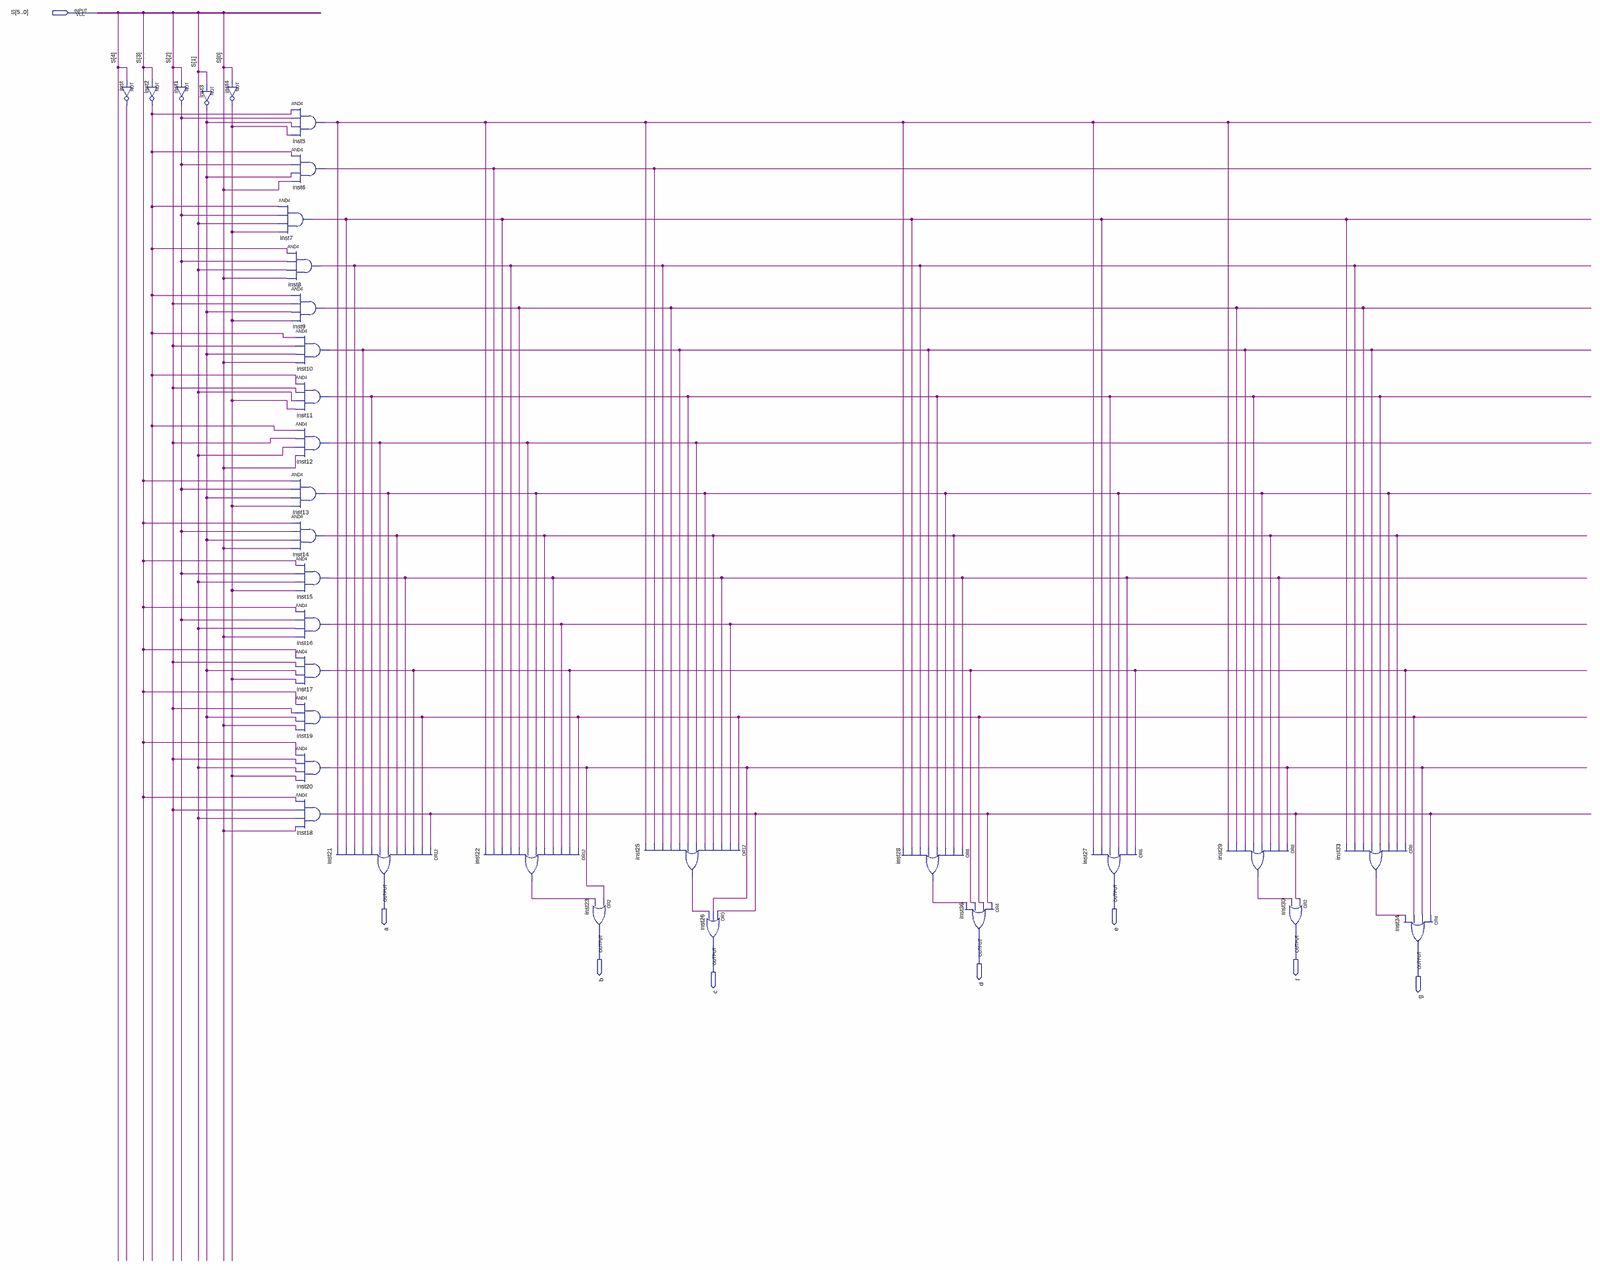
[diagram p0: schematic sheet, whole]
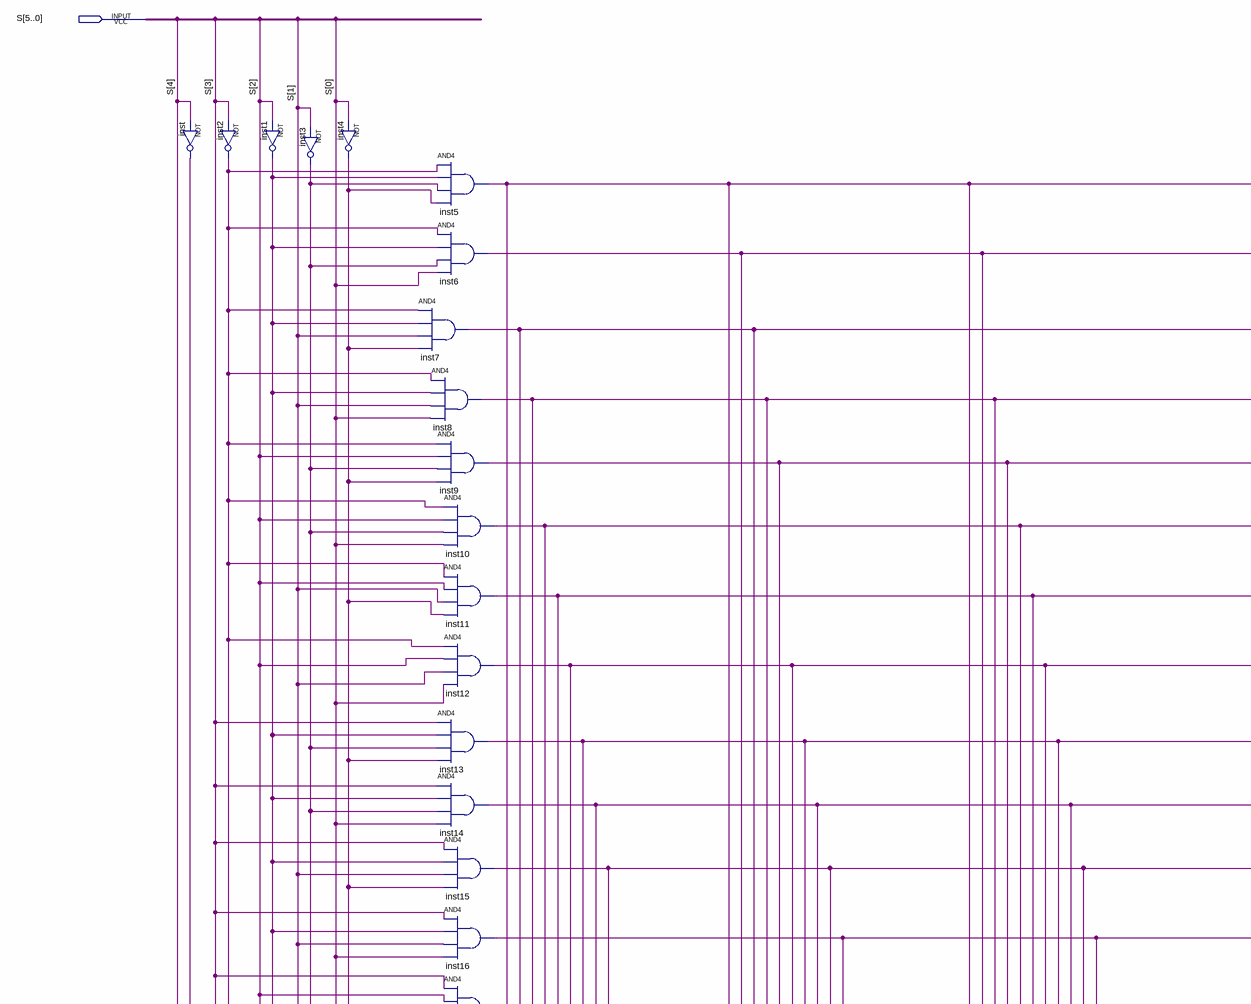
[diagram p1: schematic sheet, upper left part]
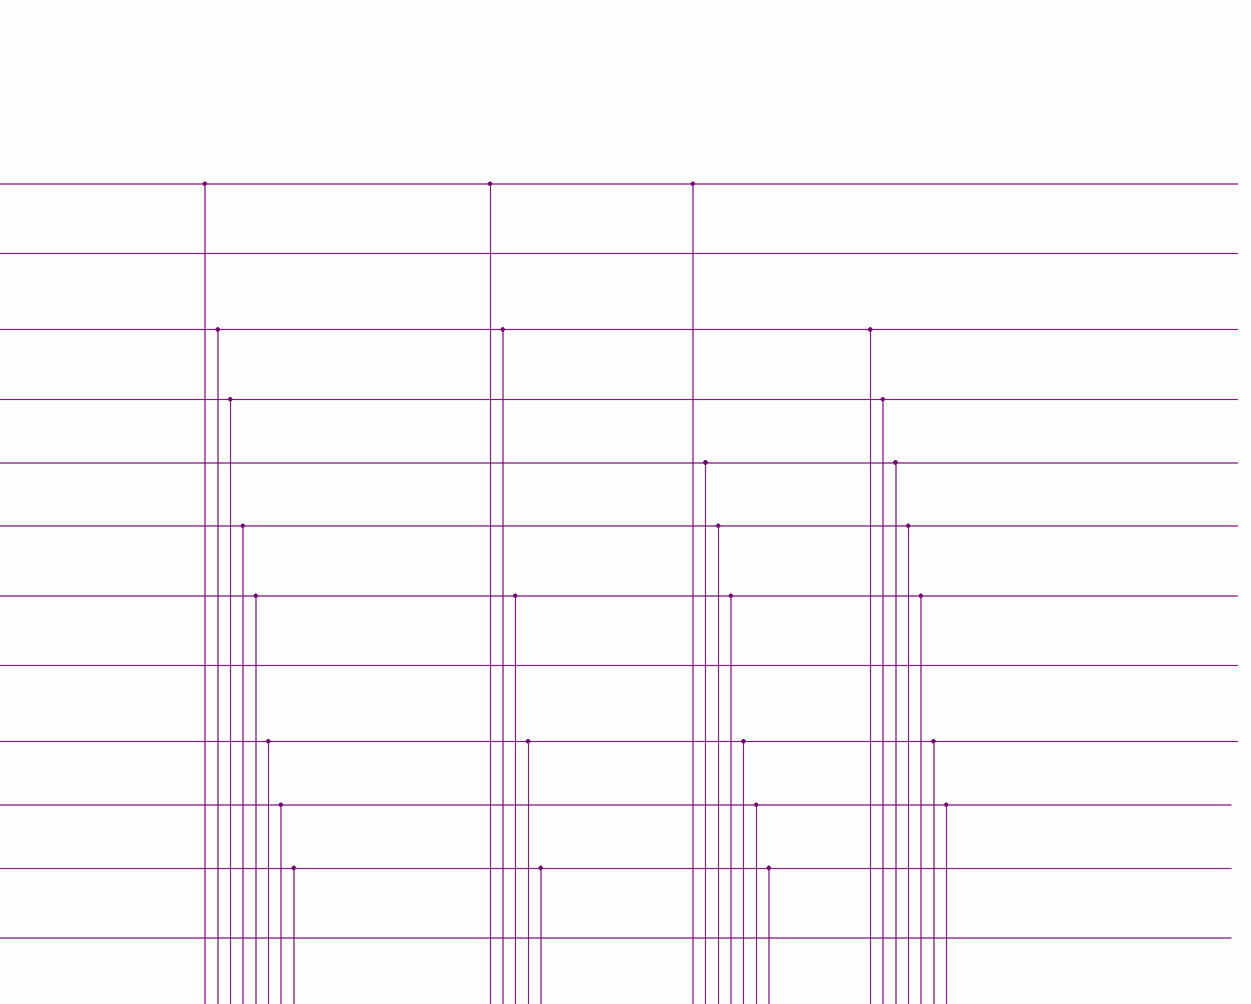
[diagram p2: schematic sheet, upper right part]
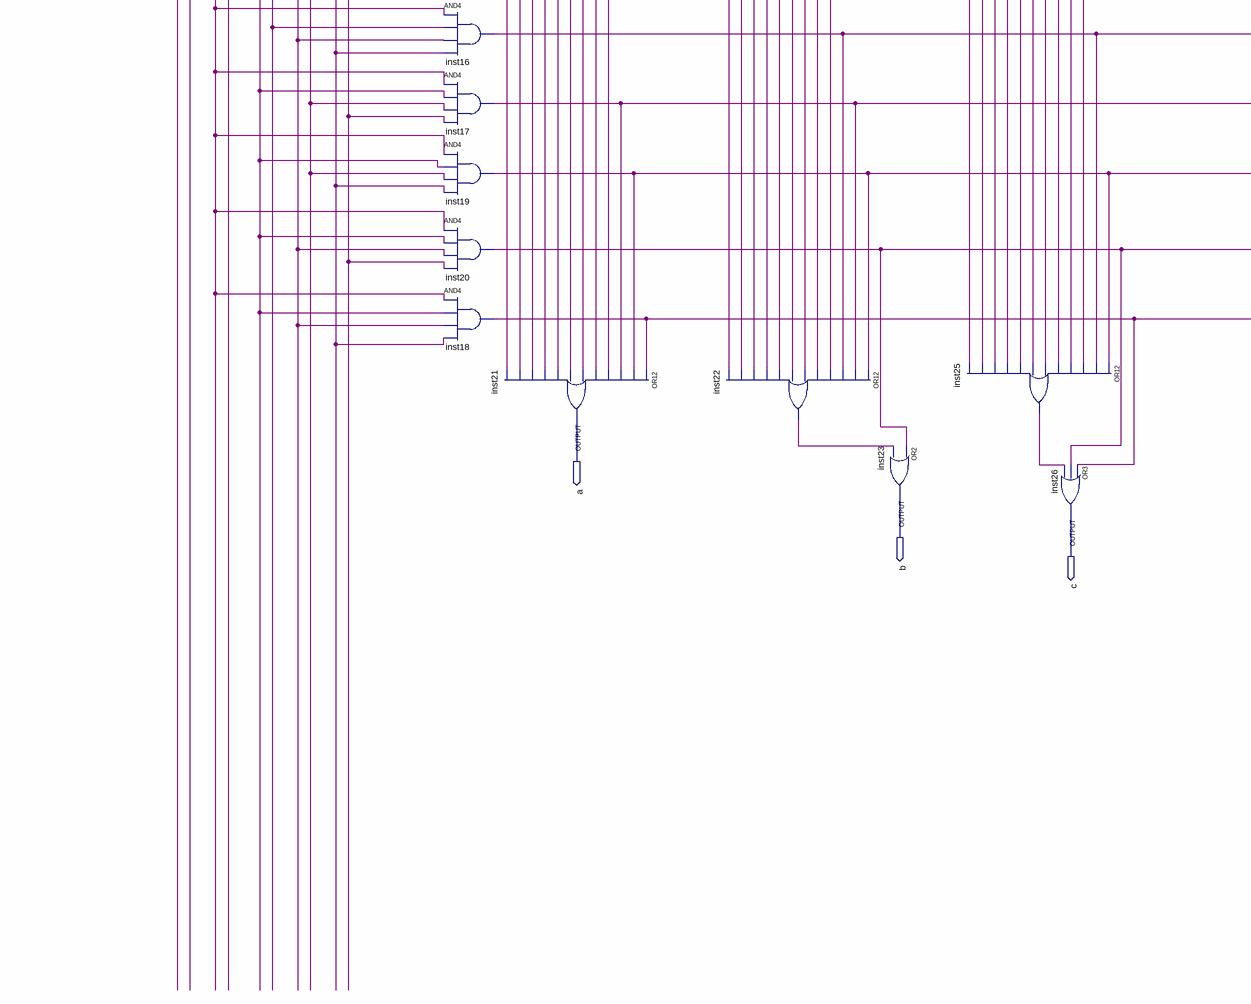
[diagram p3: schematic sheet, lower left part]
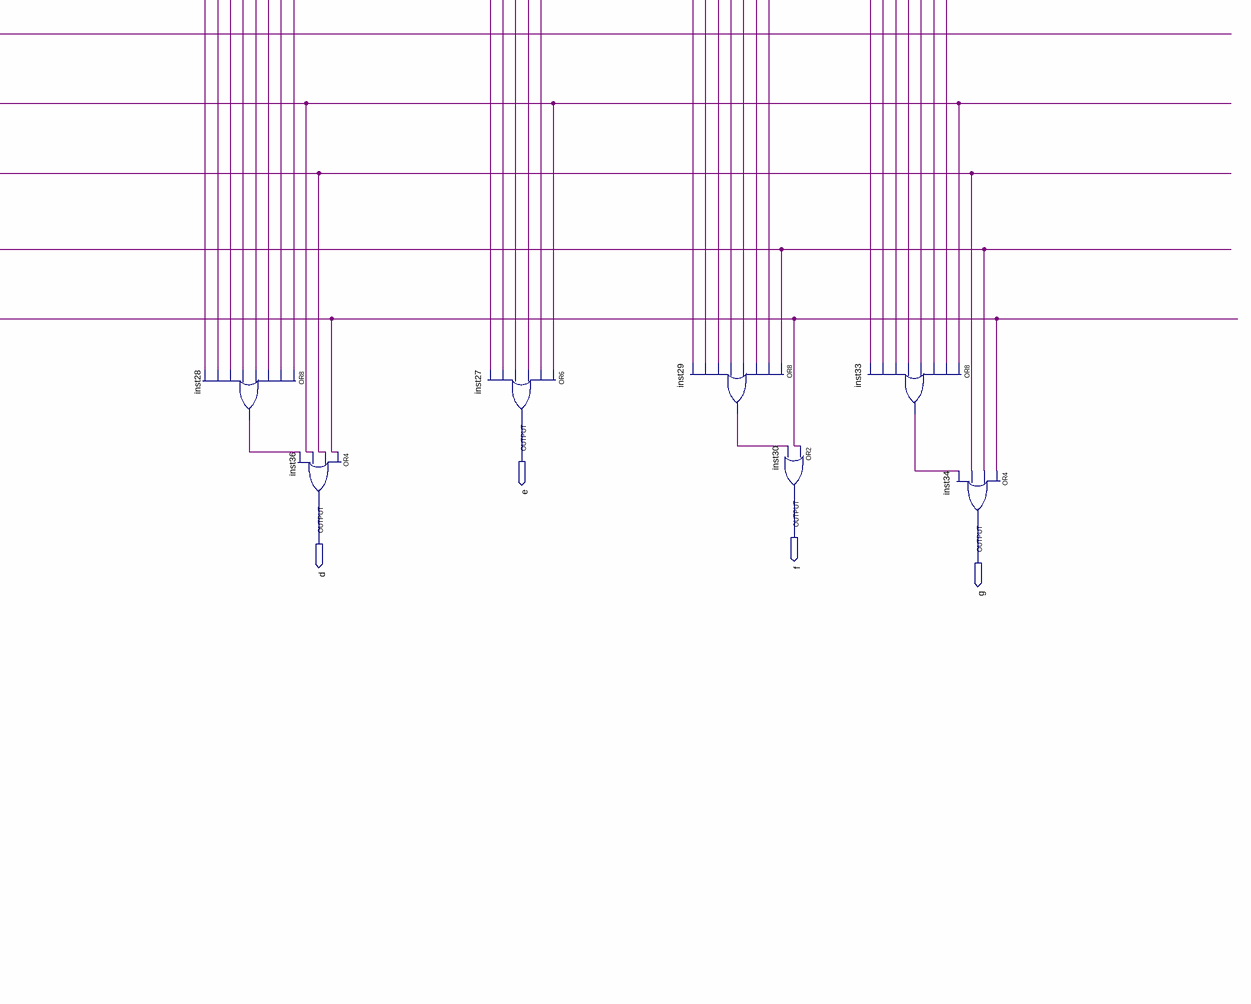
[diagram p4: schematic sheet, lower right part]
// Quartus schematic decodificador.bdf as structural Verilog: 33 symbols, 8 pins
module decodificador (
  input  [5:0] S,
  output a,
  output e,
  output b,
  output f,
  output d,
  output c,
  output g
);

  wire inst1_out, inst2_out, inst3_out, inst4_out, inst5_out, inst6_out, inst7_out, inst8_out, inst9_out,
       inst10_out, inst11_out, inst12_out, inst13_out, inst14_out, inst15_out, inst16_out, inst17_out,
       inst18_out, inst19_out, inst20_out, inst22_out, inst25_out, inst28_out, inst29_out, inst33_out,
       inst_out;

  not inst (inst_out, S[4]);
  not inst2 (inst2_out, S[3]);
  not inst1 (inst1_out, S[2]);
  not inst3 (inst3_out, S[1]);
  not inst4 (inst4_out, S[0]);
  and inst5 (inst5_out, inst2_out, inst1_out, inst3_out, inst4_out);
  and inst6 (inst6_out, inst2_out, inst1_out, inst3_out, S[0]);
  and inst7 (inst7_out, inst2_out, inst1_out, S[1], inst4_out);
  and inst8 (inst8_out, inst2_out, inst1_out, S[1], S[0]);
  and inst9 (inst9_out, inst2_out, S[2], inst3_out, inst4_out);
  and inst10 (inst10_out, inst2_out, S[2], inst3_out, S[0]);
  and inst11 (inst11_out, inst2_out, S[2], S[1], inst4_out);
  and inst12 (inst12_out, inst2_out, S[2], S[1], S[0]);
  and inst13 (inst13_out, S[3], inst1_out, inst3_out, inst4_out);
  and inst14 (inst14_out, S[3], inst1_out, inst3_out, S[0]);
  and inst15 (inst15_out, S[3], inst1_out, S[1], inst4_out);
  and inst16 (inst16_out, S[3], inst1_out, S[1], S[0]);
  and inst17 (inst17_out, S[3], S[2], inst3_out, inst4_out);
  and inst19 (inst19_out, S[3], S[2], inst3_out, S[0]);
  and inst20 (inst20_out, S[3], S[2], S[1], inst4_out);
  and inst18 (inst18_out, S[3], S[2], S[1], S[0]);
  or inst21 (a, inst18_out, inst19_out, inst17_out, inst15_out, inst14_out, inst13_out, inst12_out, inst11_out, inst10_out, inst8_out, inst7_out, inst5_out);
  or inst22 (inst22_out, inst19_out, inst17_out, inst16_out, inst15_out, inst14_out, inst13_out, inst12_out, inst9_out, inst8_out, inst7_out, inst6_out, inst5_out);
  or inst23 (b, inst20_out, inst22_out);
  or inst25 (inst25_out, inst19_out, inst16_out, inst15_out, inst14_out, inst13_out, inst12_out, inst11_out, inst10_out, inst9_out, inst8_out, inst6_out, inst5_out);
  or inst26 (c, inst18_out, inst20_out, inst25_out);
  or inst28 (inst28_out, inst15_out, inst14_out, inst13_out, inst11_out, inst10_out, inst8_out, inst7_out, inst5_out);
  or inst36 (d, inst18_out, inst19_out, inst17_out, inst28_out);
  or inst27 (e, inst17_out, inst15_out, inst13_out, inst11_out, inst7_out, inst5_out);
  or inst29 (inst29_out, inst20_out, inst15_out, inst14_out, inst13_out, inst11_out, inst10_out, inst9_out, inst5_out);
  or inst30 (f, inst18_out, inst29_out);
  or inst33 (inst33_out, inst17_out, inst14_out, inst13_out, inst11_out, inst10_out, inst9_out, inst8_out, inst7_out);
  or inst34 (g, inst18_out, inst20_out, inst19_out, inst33_out);
endmodule
